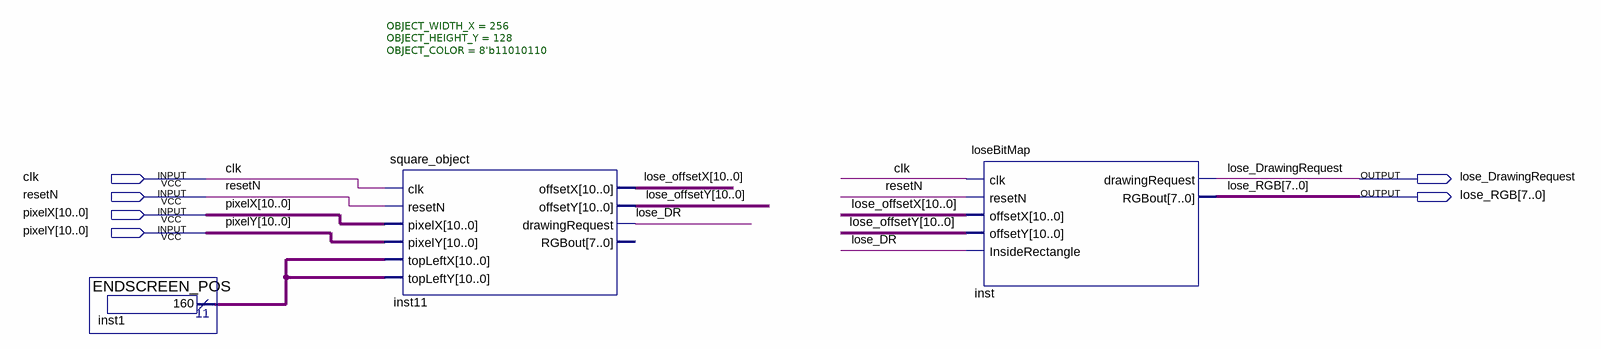
[diagram p0: schematic sheet]
// Quartus schematic LOSE_DISPLAY.bdf as structural Verilog: 3 symbols, 6 pins
module LOSE_DISPLAY (
  input  clk,
  input  resetN,
  input  [10:0] pixelX,
  input  [10:0] pixelY,
  output lose_DrawingRequest,
  output [7:0] lose_RGB
);

  wire lose_DR;
  wire [10:0] inst1_result, lose_offsetX, lose_offsetY;

  ENDSCREEN_POS inst1 (.result(inst1_result));
  square_object #(.OBJECT_WIDTH_X(256), .OBJECT_HEIGHT_Y(128), .OBJECT_COLOR(8'b11010110)) inst11 (
    .clk(clk), .resetN(resetN), .pixelX(pixelX), .pixelY(pixelY), .topLeftX(inst1_result),
    .topLeftY(inst1_result), .offsetX(lose_offsetX), .offsetY(lose_offsetY), .drawingRequest(lose_DR));  // open: RGBout
  loseBitMap inst (
    .clk(clk), .resetN(resetN), .offsetX(lose_offsetX), .offsetY(lose_offsetY), .InsideRectangle(lose_DR),
    .drawingRequest(lose_DrawingRequest), .RGBout(lose_RGB));
endmodule
